# EAGLE schematic Pr'actica_1 (EAGLE 9.6.2)
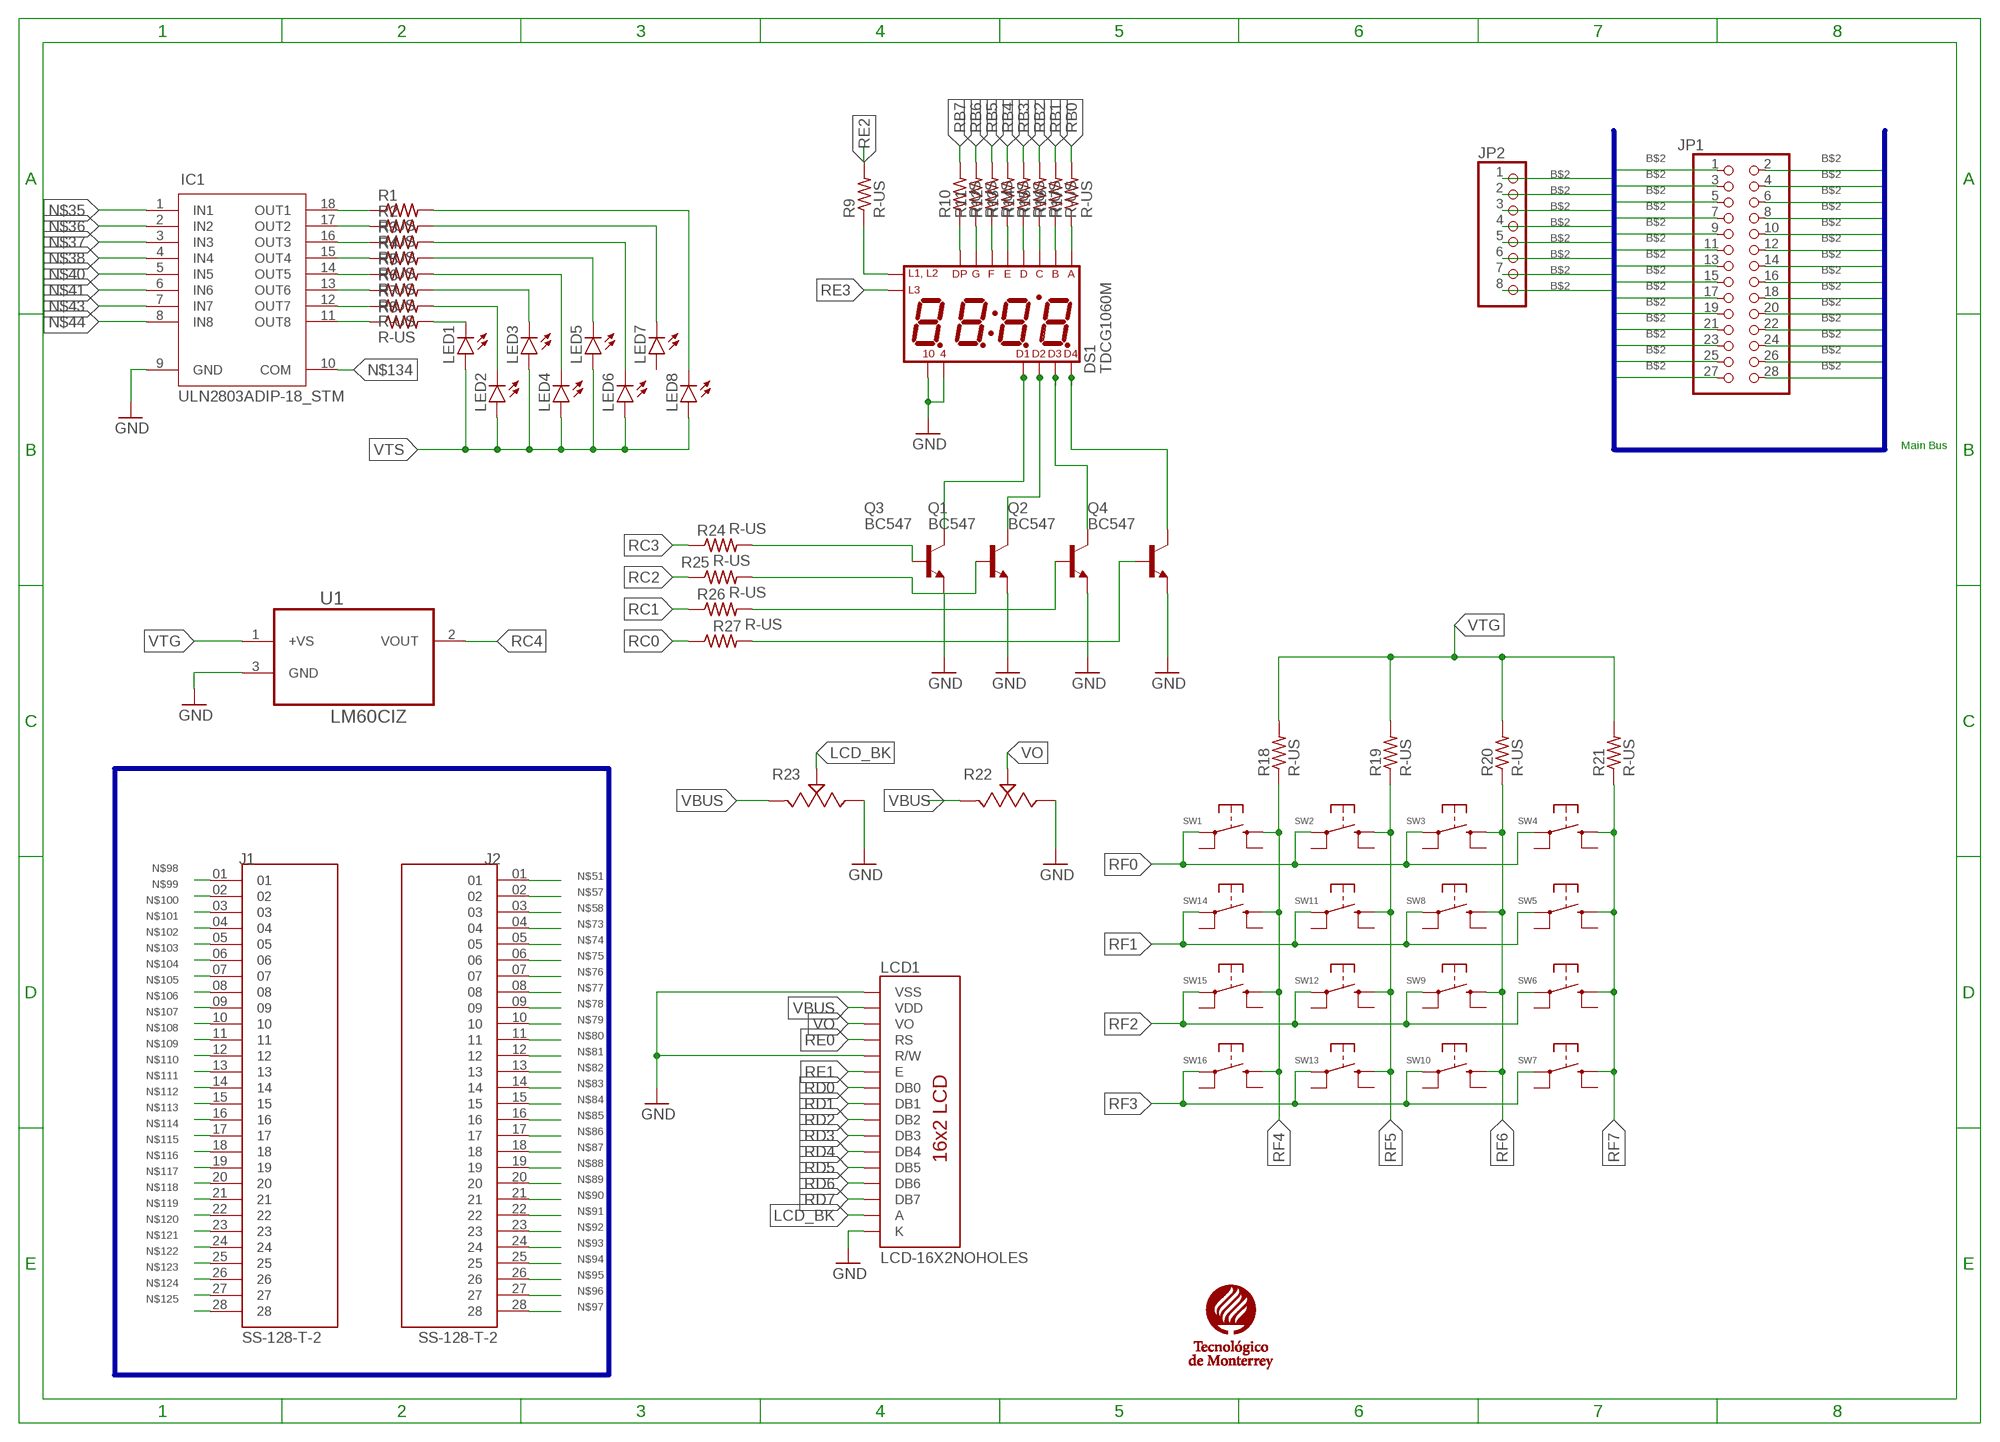
[diagram p0: schematic, sheet 1]

## Parts
DS1  TDCG1060M  [DISPLAY_TDCG1060M]
IC1  ULN2803ADIP-18_STM  [DIP-18_STM]
J1  SS-128-T-2  [SAMTEC_SS-128-T-2]
J2  SS-128-T-2  [SAMTEC_SS-128-T-2]
JP1  PINHD-2X14-CB  [2X14-BIG]
JP2  PINHD-1X8BIG  [1X08-BIG]
LCD1  LCD-16X2NOHOLES  [LCD-16X2_NOHOLESNOSILK]
LED1  LED3MM  [LED3MM]
LED2  LED3MM  [LED3MM]
LED3  LED3MM  [LED3MM]
LED4  LED3MM  [LED3MM]
LED5  LED3MM  [LED3MM]
LED6  LED3MM  [LED3MM]
LED7  LED3MM  [LED3MM]
LED8  LED3MM  [LED3MM]
Q1  BC547  [TO92]
Q2  BC547  [TO92]
Q3  BC547  [TO92]
Q4  BC547  [TO92]
R1  R-US  [0207/10]
R2  R-US  [0207/10]
R3  R-US  [0207/10]
R4  R-US  [0207/10]
R5  R-US  [0207/10]
R6  R-US  [0207/10]
R7  R-US  [0207/10]
R8  R-US  [0207/10]
R9  R-US  [0207/10]
R10  R-US  [0207/10]
R11  R-US  [0207/10]
R12  R-US  [0207/10]
R13  R-US  [0207/10]
R14  R-US  [0207/10]
R15  R-US  [0207/10]
R16  R-US  [0207/10]
R17  R-US  [0207/10]
R18  R-US  [0207/10]
R19  R-US  [0207/10]
R20  R-US  [0207/10]
R21  R-US  [0207/10]
R22  3362P-1-103LF  [3362P-1-103LF]
R23  3362P-1-103LF  [3362P-1-103LF]
R24  R-US  [0207/10]
R25  R-US  [0207/10]
R26  R-US  [0207/10]
R27  R-US  [0207/10]
SW1  1825910-2  [TE_1825910-2]
SW2  1825910-2  [TE_1825910-2]
SW3  1825910-2  [TE_1825910-2]
SW4  1825910-2  [TE_1825910-2]
SW5  1825910-2  [TE_1825910-2]
SW6  1825910-2  [TE_1825910-2]
SW7  1825910-2  [TE_1825910-2]
SW8  1825910-2  [TE_1825910-2]
SW9  1825910-2  [TE_1825910-2]
SW10  1825910-2  [TE_1825910-2]
SW11  1825910-2  [TE_1825910-2]
SW12  1825910-2  [TE_1825910-2]
SW13  1825910-2  [TE_1825910-2]
SW14  1825910-2  [TE_1825910-2]
SW15  1825910-2  [TE_1825910-2]
SW16  1825910-2  [TE_1825910-2]
TEC1  TEC_LOGO  [TEC_LOGO]
U1  LM60CIZ  [TO92/]

## Nets
B$2: JP1.1 JP1.2 JP1.3 JP1.4 JP1.5 JP1.6 JP1.7 JP1.8 JP1.9 JP1.10 JP1.11 JP1.12 JP1.13 JP1.14 JP1.15 JP1.16 JP1.17 JP1.18 JP1.19 JP1.20 JP1.21 JP1.22 JP1.23 JP1.24 JP1.25 JP1.26 JP1.27 JP1.28 JP2.1 JP2.2 JP2.3 JP2.4 JP2.5 JP2.6 JP2.7 JP2.8
GND: DS1.4 DS1.10 IC1.9(GND) LCD1.1(VSS) LCD1.5(R/W) LCD1.16(K) Q1.1(E) Q2.1(E) Q3.1(E) Q4.1(E) R22.3 R23.3 U1.3(GND)
LCD_BK: LCD1.15(A) R23.2
N$1: IC1.18(OUT1) R1.1
N$2: IC1.17(OUT2) R2.1
N$3: IC1.16(OUT3) R3.1
N$4: IC1.15(OUT4) R4.1
N$5: IC1.14(OUT5) R5.1
N$6: IC1.13(OUT6) R6.1
N$7: IC1.12(OUT7) R7.1
N$8: IC1.11(OUT8) R8.1
N$9: LED1.K(C) R8.2
N$10: LED2.K(C) R7.2
N$11: LED3.K(C) R6.2
N$12: LED4.K(C) R5.2
N$13: LED5.K(C) R4.2
N$14: LED6.K(C) R3.2
N$15: LED7.K(C) R2.2
N$16: LED8.K(C) R1.2
N$17: DS1.12(L1_L2) R9.1
N$18: DS1.7(DP) R10.1
N$19: DS1.15(G) R11.1
N$20: DS1.11(F) R12.1
N$21: DS1.5(E) R13.1
N$22: DS1.3(D) R14.1
N$23: DS1.13(C) R15.1
N$24: DS1.16(B) R16.1
N$25: DS1.14(A) R17.1
N$35: IC1.1(IN1)
N$36: IC1.2(IN2)
N$37: IC1.3(IN3)
N$38: IC1.4(IN4)
N$40: IC1.5(IN5)
N$41: IC1.6(IN6)
N$43: IC1.7(IN7)
N$44: IC1.8(IN8)
N$51: J2.01
N$52: DS1.1(DIG1) Q3.3(C)
N$53: DS1.2(DIG2) Q1.3(C)
N$54: DS1.6(DIG3) Q2.3(C)
N$55: DS1.8(DIG4) Q4.3(C)
N$57: J2.02
N$58: J2.03
N$73: J2.04
N$74: J2.05
N$75: J2.06
N$76: J2.07
N$77: J2.08
N$78: J2.09
N$79: J2.10
N$80: J2.11
N$81: J2.12
N$82: J2.13
N$83: J2.14
N$84: J2.15
N$85: J2.16
N$86: J2.17
N$87: J2.18
N$88: J2.19
N$89: J2.20
N$90: J2.21
N$91: J2.22
N$92: J2.23
N$93: J2.24
N$94: J2.25
N$95: J2.26
N$96: J2.27
N$97: J2.28
N$98: J1.01
N$99: J1.02
N$100: J1.03
N$101: J1.04
N$102: J1.05
N$103: J1.06
N$104: J1.07
N$105: J1.08
N$106: J1.09
N$107: J1.10
N$108: J1.11
N$109: J1.12
N$110: J1.13
N$111: J1.14
N$112: J1.15
N$113: J1.16
N$114: J1.17
N$115: J1.18
N$116: J1.19
N$117: J1.20
N$118: J1.21
N$119: J1.22
N$120: J1.23
N$121: J1.24
N$122: J1.25
N$123: J1.26
N$124: J1.27
N$125: J1.28
N$126: Q3.2(B) R24.2
N$127: Q1.2(B) R25.2
N$128: Q2.2(B) R26.2
N$129: Q4.2(B) R27.2
N$134: IC1.10(COM)
RB0: R17.2
RB1: R16.2
RB2: R15.2
RB3: R14.2
RB4: R13.2
RB5: R12.2
RB6: R11.2
RB7: R10.2
RC0: R27.1
RC1: R26.1
RC2: R25.1
RC3: R24.1
RC4: U1.2(VOUT)
RD0: LCD1.7(DB0)
RD1: LCD1.8(DB1)
RD2: LCD1.9(DB2)
RD3: LCD1.10(DB3)
RD4: LCD1.11(DB4)
RD5: LCD1.12(DB5)
RD6: LCD1.13(DB6)
RD7: LCD1.14(DB7)
RE0: LCD1.4(RS)
RE1: LCD1.6(E)
RE2: R9.2
RE3: DS1.9(L3)
RF0: SW1.1(P) SW2.1(P) SW3.1(P) SW4.1(P)
RF1: SW5.1(P) SW8.1(P) SW11.1(P) SW14.1(P)
RF2: SW6.1(P) SW9.1(P) SW12.1(P) SW15.1(P)
RF3: SW7.1(P) SW10.1(P) SW13.1(P) SW16.1(P)
RF4: R18.1 SW1.2(S) SW14.2(S) SW15.2(S) SW16.2(S)
RF5: R19.1 SW2.2(S) SW11.2(S) SW12.2(S) SW13.2(S)
RF6: R20.1 SW3.2(S) SW8.2(S) SW9.2(S) SW10.2(S)
RF7: R21.1 SW4.2(S) SW5.2(S) SW6.2(S) SW7.2(S)
VBUS: LCD1.2(VDD) R22.1 R23.1
VO: LCD1.3(VO) R22.2
VTG: R18.2 R19.2 R20.2 R21.2 U1.1(+VS)
VTS: LED1.A LED2.A LED3.A LED4.A LED5.A LED6.A LED8.A
Unconnected: LED7.A SW1.3(P1) SW1.4(S1) SW2.3(P1) SW2.4(S1) SW3.3(P1) SW3.4(S1) SW4.3(P1) SW4.4(S1) SW5.3(P1) SW5.4(S1) SW6.3(P1) SW6.4(S1) SW7.3(P1) SW7.4(S1) SW8.3(P1) SW8.4(S1) SW9.3(P1) SW9.4(S1) SW10.3(P1) SW10.4(S1) SW11.3(P1) SW11.4(S1) SW12.3(P1) SW12.4(S1) SW13.3(P1) SW13.4(S1) SW14.3(P1) SW14.4(S1) SW15.3(P1) SW15.4(S1) SW16.3(P1) SW16.4(S1)

## Buses
B$2
B$1

## Notes on the sheet
- Main Bus

## Library data of the parts
DS1 = TE2015_Microcontroladores:TDCG1060M: Clockmodule 10mm Green m.Plex c.c.-E4; DESCRIPTION: Display Modules - LED Character and Numeric Green 7-Segment Clock 4 Character Common Cathode 2V 20mA 0.504 H x 1.583 W x 0.276 D (12.80mm x 40.20mm x 7.00mm) 16-DIP (0.400, 10.16mm); DIGI-KEY_PART_NUMBER: TDCG1060M-ND; MF: Vishay; MP: TDCG1060M; PACKAGE: None; PURCHASE-URL: https://pricing.snapeda.com/search/part/TDCG1060M/?ref=eda
IC1 = TE2015_Microcontroladores:ULN2803A; COPYRIGHT: Copyright (C) 2022 Ultra Librarian. All rights reserved.; DIGI-KEY_PART_NUMBER_1: 497-2356-5-ND; MANUFACTURER_PART_NUMBER: ULN2803A; MFR_NAME: STMicroelectronics
J1 J2 = TE2015_Microcontroladores:SS-128-T-2; DESCRIPTION: 28 Position Receptacle Connector 0.100 (2.54mm) Through Hole Gold; DIGI-KEY_PART_NUMBER: SAM1117-28-ND; MF: Samtec; MP: SS-128-T-2; PACKAGE: None; PURCHASE-URL: https://pricing.snapeda.com/search/part/SS-128-T-2/?ref=eda
JP1 = TE2015_Microcontroladores:PINHD-2X14: PIN HEADER
JP2 = TE2015_Microcontroladores:PINHD-1X8: PIN HEADER
LCD1 = TE2015_Microcontroladores:LCD-16X2: Standard text-only 16x2 parallel input LCD Basic 16 character by 2 line display. Typically utilizes the extremely common HD44780 parallel interface chipset SparkFun Products: Basic 16x2 Green <https://www.sparkfun.com/products/255> Basic 8x2 Green <https://www.sparkfun.com/products/11122>; SF_ID: LCD-00255
LED1-LED8 = TE2015_Microcontroladores:LED3MM
Q1-Q4 = transistor-npn:BC547*: NPN Transistor
R1-R21 R24-R27 = TE2015_Microcontroladores:R-US; SPICEPREFIX: R
R22 R23 = TE2015_Microcontroladores:3362P-1-103LF: TRIMMER 10K OHM 0.5W PC PIN TOP Manufacturer's datasheet <https://www.bourns.com/docs/Product-Datasheets/3362.pdf>; CREATED_PN: PCBLayout.com; DIGIKEY_PN: 3362P-103LF-ND; MANUFACTURER: Bourns Inc.; MPN: 3362P-1-103LF
SW1-SW16 = TE2015_Microcontroladores:1825910-2: SWITCH TACTILE SPST-NO 0.05A 24V Check availability <https://pricing.snapeda.com/parts/1825910-2/TE%20Connectivity/view-part?ref=eda>; AVAILABILITY: In Stock; COMMENT: 1825910-2; CONFIGURATION_POLE-THROW: Single Pole - Single Throw; CONTACT_CURRENT_RATING: 50 mA; DESCRIPTION: 50 mA SPST Round Actuator 160 Gram Force Tactile Pushbutton Switch; EU_ROHS_COMPLIANCE: Compliant; MF: TE Connectivity; MP: 1825910-2; PACKAGE: None; PRICE: None; PURCHASE-URL: https://pricing.snapeda.com/search/part/1825910-2/?ref=eda
TEC1 = TE2015_Microcontroladores:TEC_LOGO
U1 = TE2015_Microcontroladores:LM60CIZ: IC, TEMPERATURE SENSOR, ± 3°C